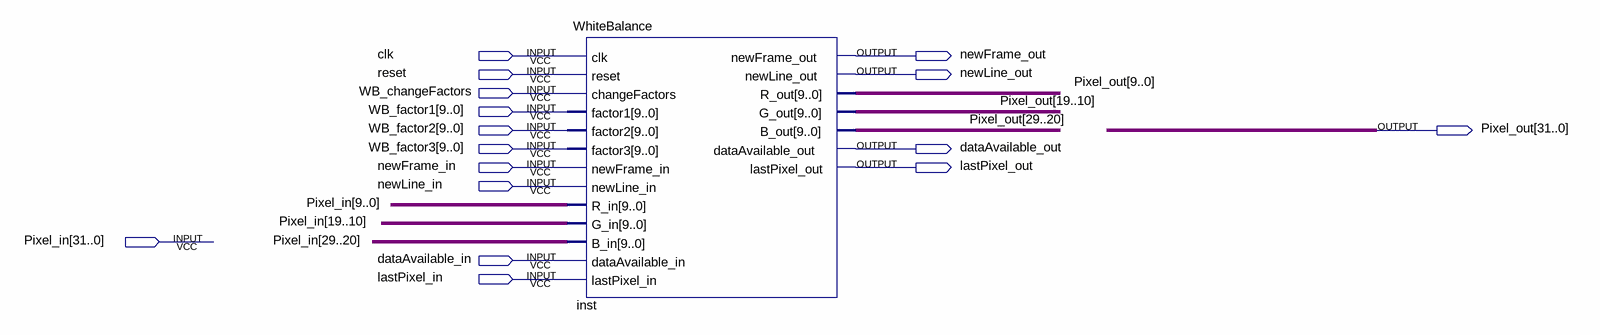
[diagram p0: schematic sheet]
// Quartus schematic ColorTreatment_block.bdf as structural Verilog: 1 symbols, 16 pins
module ColorTreatment_block (
  input  clk,
  input  reset,
  input  WB_changeFactors,
  input  [9:0] WB_factor1,
  input  [9:0] WB_factor2,
  input  [9:0] WB_factor3,
  input  newFrame_in,
  input  newLine_in,
  input  [31:0] Pixel_in,
  input  dataAvailable_in,
  input  lastPixel_in,
  output newFrame_out,
  output newLine_out,
  output [31:0] Pixel_out,
  output dataAvailable_out,
  output lastPixel_out
);

  WhiteBalance inst (
    .clk(clk), .reset(reset), .changeFactors(WB_changeFactors), .factor1(WB_factor1), .factor2(WB_factor2),
    .factor3(WB_factor3), .newFrame_in(newFrame_in), .newLine_in(newLine_in), .R_in(Pixel_in[9:0]),
    .G_in(Pixel_in[19:10]), .B_in(Pixel_in[29:20]), .dataAvailable_in(dataAvailable_in),
    .lastPixel_in(lastPixel_in), .newFrame_out(newFrame_out), .newLine_out(newLine_out),
    .R_out(Pixel_out[9:0]), .G_out(Pixel_out[19:10]), .B_out(Pixel_out[29:20]),
    .dataAvailable_out(dataAvailable_out), .lastPixel_out(lastPixel_out));
endmodule
